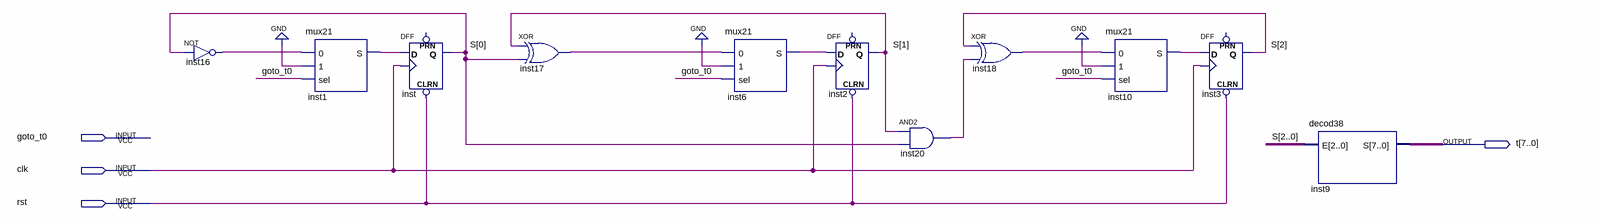
[diagram p0: schematic sheet]
// Quartus schematic temporizer.bdf as structural Verilog: 11 symbols, 4 pins
module temporizer (
  input  goto_t0,
  input  clk,
  input  rst,
  output [7:0] t
);

  wire inst1_s, inst6_s, inst10_s, inst16_out, inst17_out, inst18_out, inst20_out;
  wire [2:0] S;

  not inst16 (inst16_out, S[0]);
  mux21 inst1 (.\0 (inst16_out), .\1 (1'b0), .sel(goto_t0), .S(inst1_s));
  DFF inst (.CLRN(rst), .CLK(clk), .D(inst1_s), .Q(S[0]));  // open: PRN
  xor inst17 (inst17_out, S[1], S[0]);
  mux21 inst6 (.\0 (inst17_out), .\1 (1'b0), .sel(goto_t0), .S(inst6_s));
  DFF inst2 (.CLRN(rst), .CLK(clk), .D(inst6_s), .Q(S[1]));  // open: PRN
  and inst20 (inst20_out, S[1], S[0]);
  xor inst18 (inst18_out, S[2], inst20_out);
  mux21 inst10 (.\0 (inst18_out), .\1 (1'b0), .sel(goto_t0), .S(inst10_s));
  DFF inst3 (.CLRN(rst), .CLK(clk), .D(inst10_s), .Q(S[2]));  // open: PRN
  decod38 inst9 (.E(S), .S(t));
endmodule
